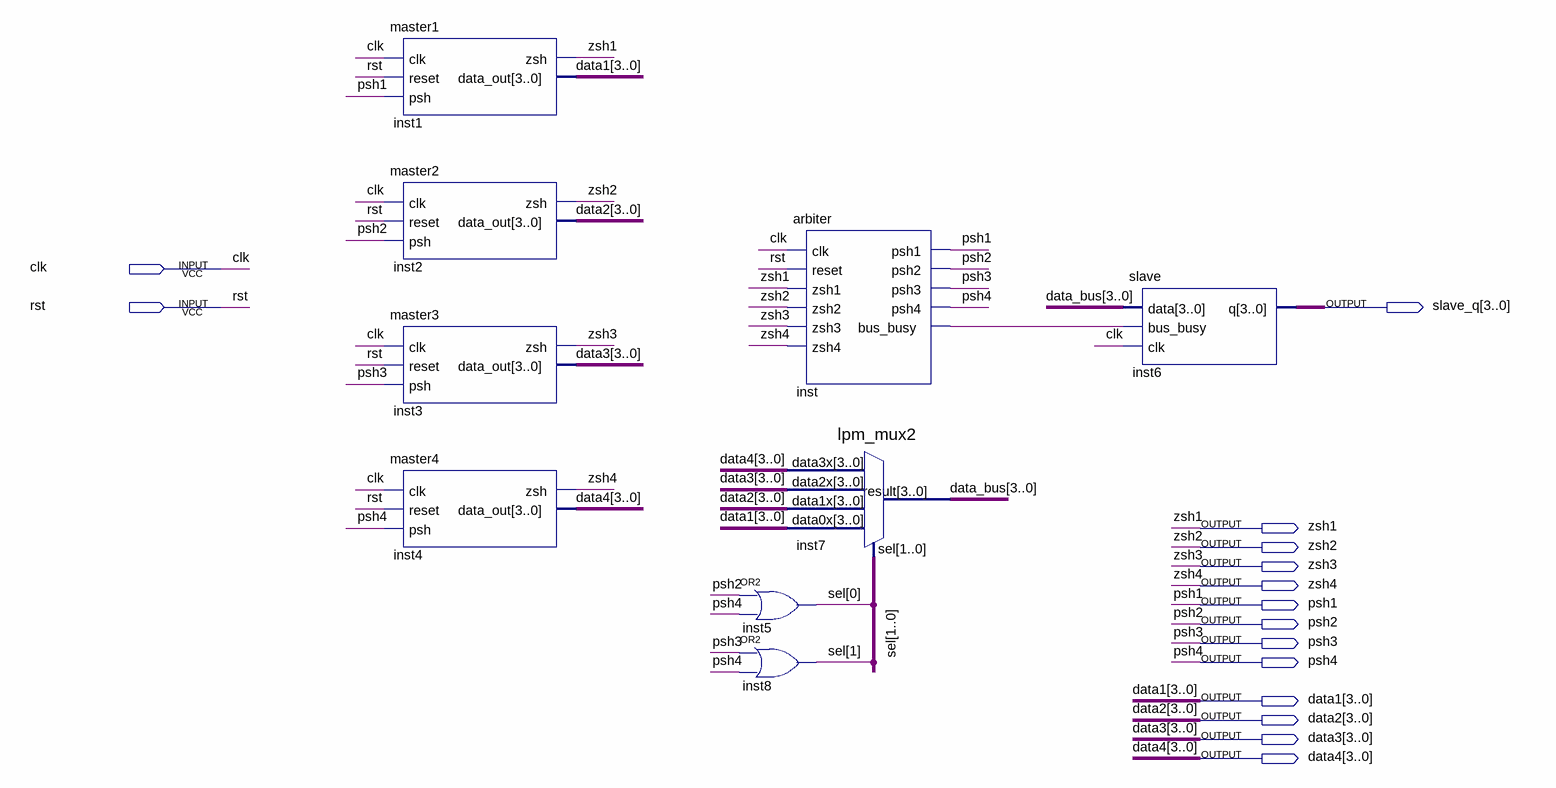
[diagram p0: schematic sheet]
// Quartus schematic top.bdf as structural Verilog: 9 symbols, 15 pins
module top (
  input  clk,
  input  rst,
  output [3:0] slave_q,
  output zsh1,
  output zsh2,
  output zsh3,
  output zsh4,
  output psh1,
  output psh2,
  output psh3,
  output psh4,
  output [3:0] data1,
  output [3:0] data2,
  output [3:0] data3,
  output [3:0] data4
);

  wire inst_bus_busy;
  wire [1:0] sel;
  wire [3:0] data_bus;

  master1 inst1 (.clk(clk), .reset(rst), .psh(psh1), .zsh(zsh1), .data_out(data1));
  master2 inst2 (.clk(clk), .reset(rst), .psh(psh2), .zsh(zsh2), .data_out(data2));
  master3 inst3 (.clk(clk), .reset(rst), .psh(psh3), .zsh(zsh3), .data_out(data3));
  master4 inst4 (.clk(clk), .reset(rst), .psh(psh4), .zsh(zsh4), .data_out(data4));
  arbiter inst (
    .clk(clk), .reset(rst), .zsh1(zsh1), .zsh2(zsh2), .zsh3(zsh3), .zsh4(zsh4), .psh1(psh1), .psh2(psh2),
    .psh3(psh3), .psh4(psh4), .bus_busy(inst_bus_busy));
  lpm_mux2 inst7 (.data3x(data4), .data2x(data3), .data1x(data2), .data0x(data1), .sel(sel), .result(data_bus));
  or inst5 (sel[0], psh2, psh4);
  or inst8 (sel[1], psh3, psh4);
  slave inst6 (.data(data_bus), .bus_busy(inst_bus_busy), .clk(clk), .q(slave_q));
endmodule
